# EAGLE design Arduino Nano with 7 segment display (EAGLE 7.2.0)
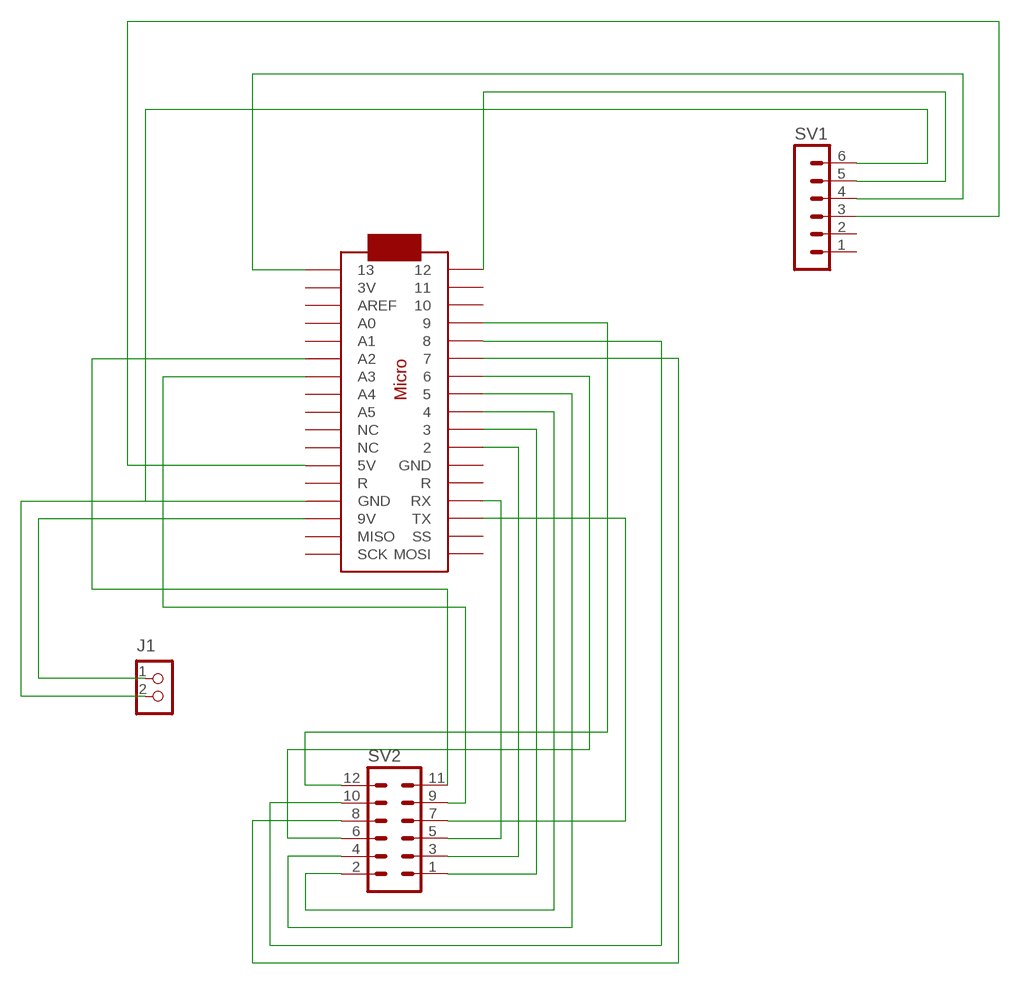
[diagram p0: schematic, sheet 1]

## Parts
J1  CON_TERMINAL_BLOCK_02-5MM  [TERMINAL_BLOCK_2P_5]
SV1  MA06-1  [MA06-1]
SV2  MA06-2  [MA06-2]
U$1  ARDUINOMICRO  [ARDUINOMICRO]

## Nets
N$1: J1.2 SV1.6 U$1.P$12(GND)
N$2: SV1.3 U$1.P$23(5V)
N$3: SV1.5 U$1.P$1
N$4: SV1.4 U$1.P$34
N$5: SV2.1 U$1.P$10
N$6: SV2.12 U$1.P$4
N$7: SV2.6 U$1.P$7
N$8: SV2.4 U$1.P$8
N$9: SV2.10 U$1.P$5
N$10: SV2.8 U$1.P$6
N$11: SV2.2 U$1.P$9
N$12: SV2.3 U$1.P$11
N$13: SV2.11 U$1.P$29(A2)
N$14: SV2.9 U$1.P$28(A3)
N$15: SV2.5 U$1.P$14(RX)
N$16: SV2.7 U$1.P$15(TX)
N$17: J1.1 U$1.P$20(9V)
Unconnected: SV1.1 SV1.2 U$1.P$2 U$1.P$3 U$1.P$13(R) U$1.P$16(SS) U$1.P$17(MOSI) U$1.P$18(SCK) U$1.P$19(MISO) U$1.P$21(GND) U$1.P$22(R) U$1.P$24(NC) U$1.P$25(NC) U$1.P$26(A5) U$1.P$27(A4) U$1.P$30(A1) U$1.P$31(A0) U$1.P$32(AREF) U$1.P$33(3V)

## Library data of the parts
J1 = dp_devices:CON_TERMINAL_BLOCK_02: 2 poles wire to board terminal block
SV1 = con-lstb:MA06-1: PIN HEADER; OC_FARNELL: unknown; OC_NEWARK: unknown
SV2 = con-lstb:MA06-2: PIN HEADER; OC_FARNELL: unknown; OC_NEWARK: unknown
U$1 = adafruit:ARDUINOMICRO

## Board
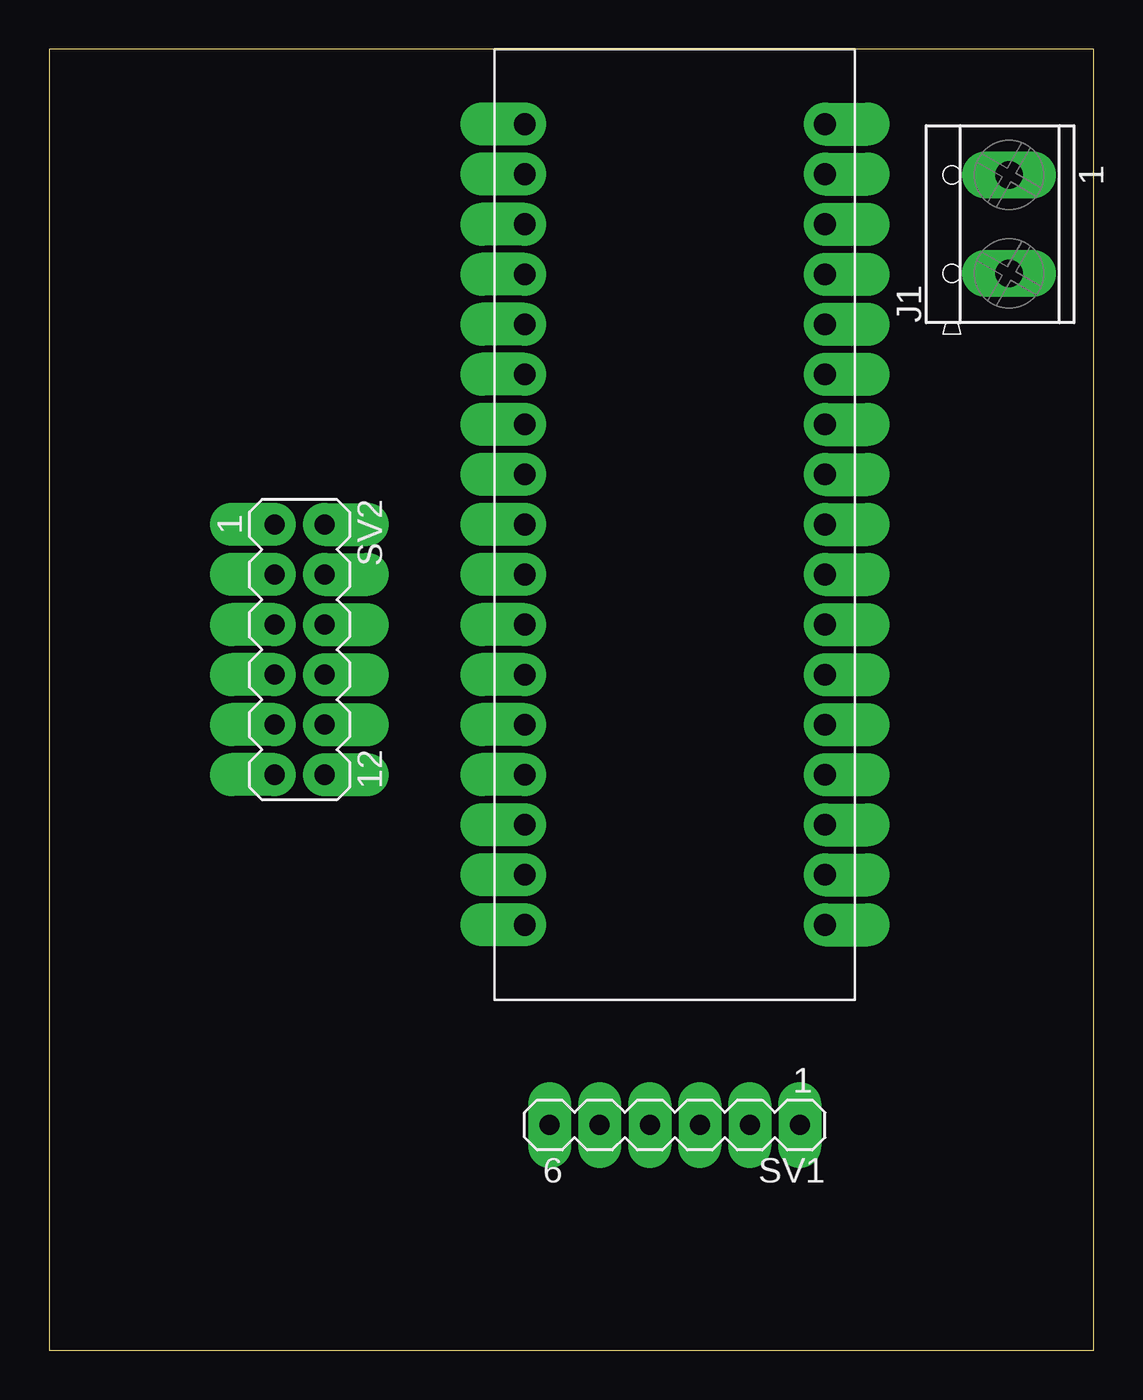
[diagram p1: board, top side]
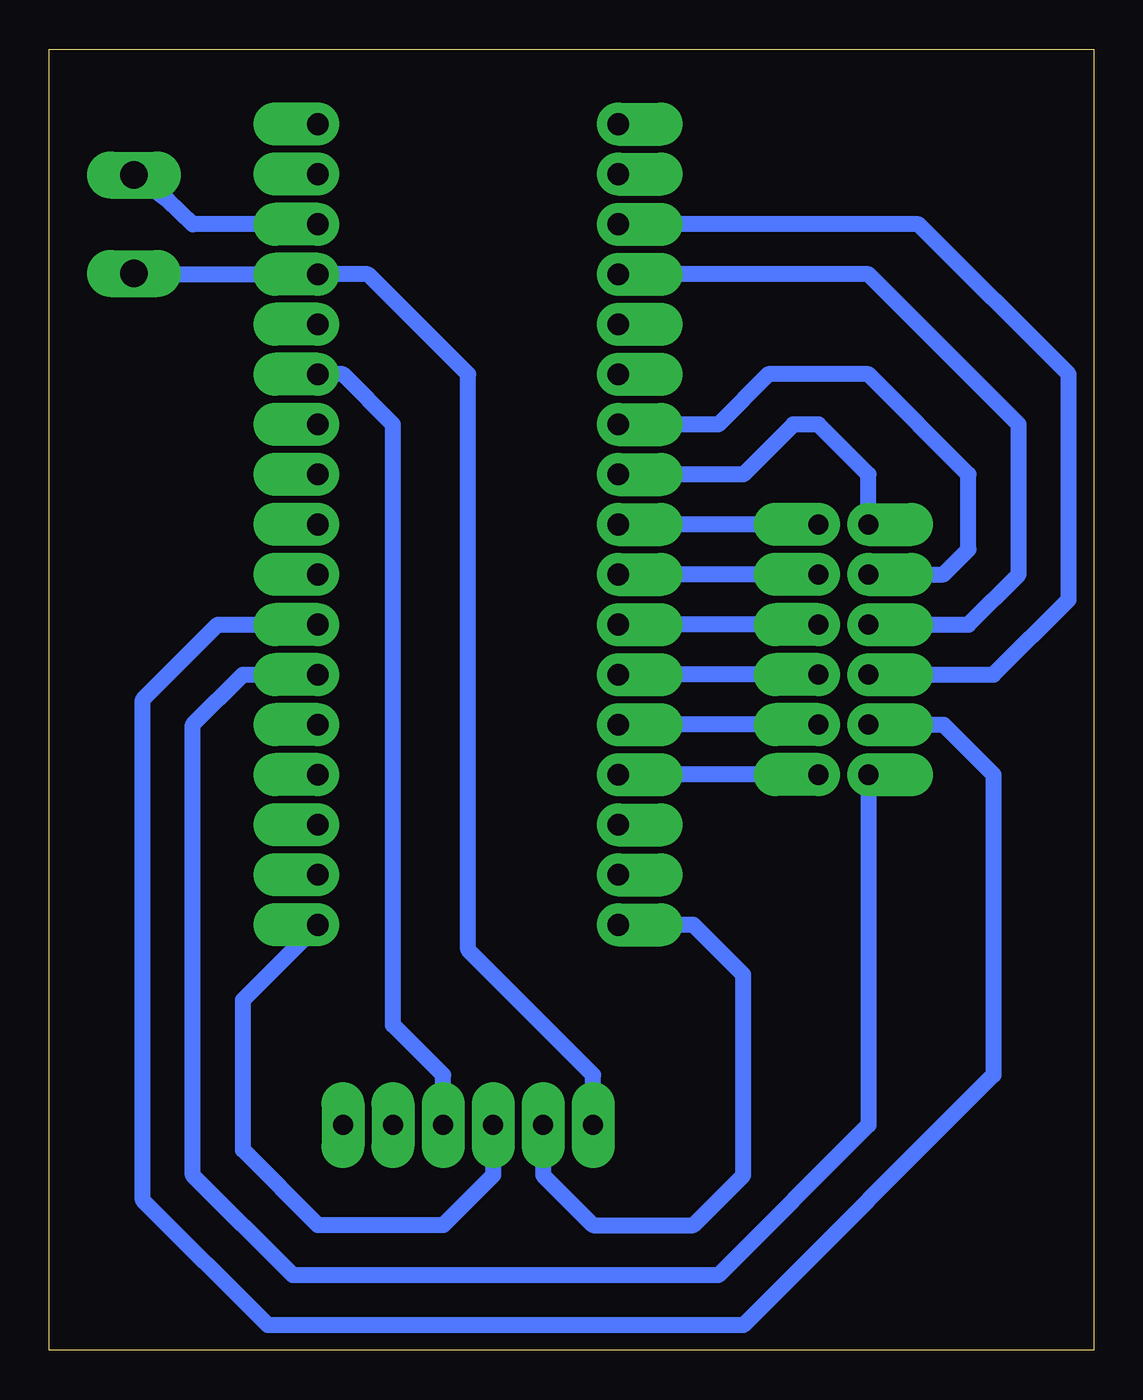
[diagram p2: board, bottom side, seen from below]

Size 53.01 x 66.03 mm. Coordinates in mm from the lower left corner, seen from the top.
Outline: 0,0 53.01,0 53.01,66.03 0,66.03 0,0
Copper layers (1*16): Top 0.035mm / dielectric 1.5mm / Bottom 0.035mm
Design rules "default": minimum track width 40mil, minimum drill 24mil, track to track 40mil, track to pad 40mil, pad to pad 40mil, via to via 40mil, smd to smd 8mil, copper to edge 40mil, drill to drill 8mil, minimum pad ring 10mil, minimum via ring 8mil, stop-mask expansion 4mil, vias tented up to drill 0mil, thermal gap 10mil

### Footprints (pad centres in the part's own frame; a part is rotated, then mirrored left to right if it is on the bottom)
TERMINAL_BLOCK_2P_5 = drill 1.4 pad 2.38 long: 1 2.5,-0.45; 2 -2.5,-0.45
MA06-1 = drill 1.016 pad 2.184 long: 1 -6.35,0; 2 -3.81,0; 3 -1.27,0; 4 1.27,0; 5 3.81,0; 6 6.35,0
MA06-2 = drill 1.016 pad 2.184 offset: 1 -6.35,-1.27; 2 -6.35,1.27; 3 -3.81,-1.27; 4 -3.81,1.27; 5 -1.27,-1.27; 6 -1.27,1.27; 7 1.27,-1.27; 8 1.27,1.27; 9 3.81,-1.27; 10 3.81,1.27; 11 6.35,-1.27; 12 6.35,1.27
ARDUINOMICRO = drill 1.1 pad 2.184 offset: P$1 -20.32,7.62; P$2 -17.78,7.62; P$3 -15.24,7.62; P$4 -12.7,7.62; P$5 -10.16,7.62; P$6 -7.62,7.62; P$7 -5.08,7.62; P$8 -2.54,7.62; P$9 0,7.62; P$10 2.54,7.62; P$11 5.08,7.62; P$12 12.7,-7.62; P$13 10.16,-7.62; P$14 12.7,7.62; P$15 15.24,7.62; P$16 17.78,7.62; P$17 20.32,7.62; P$18 20.32,-7.62; P$19 17.78,-7.62; P$20 15.24,-7.62; P$21 7.62,7.62; P$22 10.16,7.62; P$23 7.62,-7.62; P$24 5.08,-7.62; P$25 2.54,-7.62; P$26 0,-7.62; P$27 -2.54,-7.62; P$28 -5.08,-7.62; P$29 -7.62,-7.62; P$30 -10.16,-7.62; P$31 -12.7,-7.62; P$32 -15.24,-7.62; P$33 -17.78,-7.62; P$34 -20.32,-7.62

### Placement (x,y rotation side)
J1  48.26,57.15 90 top
SV1  31.75,11.43 180 top
SV2  12.7,35.56 270 top
U$1  31.75,41.91 90 top

### Tracks (layer width: path | path; a pad name or v marks a point on that pad's centre or on a via)
N$1
  Bottom 0.813: SV1.6 25.4,13.97 31.75,20.32 31.75,49.53 36.83,54.61 U$1.P$12 48.71,54.61 J1.2
N$2
  Bottom 0.813: SV1.3 33.02,13.97 35.56,16.51 35.56,46.99 38.1,49.53 U$1.P$23
N$3
  Bottom 0.813: SV1.5 27.94,8.89 25.4,6.35 20.32,6.35 17.78,8.89 17.78,19.05 20.32,21.59 U$1.P$1
N$4
  Bottom 0.813: SV1.4 30.48,8.89 33.02,6.35 39.37,6.35 43.18,10.16 43.18,17.78 U$1.P$34
N$5
  Bottom 0.813: SV2.1 11.43,44.45 13.97,46.99 15.24,46.99 17.78,44.45 U$1.P$10
N$6
  Bottom 0.813: SV2.12 U$1.P$4
N$7
  Bottom 0.813: SV2.6 U$1.P$7
N$8
  Bottom 0.813: SV2.4 U$1.P$8
N$9
  Bottom 0.813: SV2.10 U$1.P$5
N$10
  Bottom 0.813: SV2.8 U$1.P$6
N$11
  Bottom 0.813: SV2.2 U$1.P$9
N$12
  Bottom 0.813: SV2.3 7.62,39.37 6.35,40.64 6.35,44.45 11.43,49.53 16.51,49.53 19.05,46.99 U$1.P$11
N$13
  Bottom 0.813: SV2.11 11.43,11.43 19.05,3.81 40.64,3.81 45.72,8.89 45.72,31.75 43.18,34.29 U$1.P$29
N$14
  Bottom 0.813: SV2.9 7.62,31.75 5.08,29.21 5.08,13.97 17.78,1.27 41.91,1.27 48.26,7.62 48.26,33.02 44.45,36.83 U$1.P$28
N$15
  Bottom 0.813: SV2.5 6.35,36.83 3.81,39.37 3.81,46.99 11.43,54.61 U$1.P$14
N$16
  Bottom 0.813: SV2.7 5.08,34.29 1.27,38.1 1.27,49.53 8.89,57.15 U$1.P$15
N$17
  Bottom 0.813: U$1.P$20 45.72,57.15 46.99,58.38 J1.1